# Altium schematic sheet connections.SchDoc
size A4; PageSetup: Record=PageOptions|CenterHorizontal=False|CenterVertical=False|PrintScale=1.00|XCorrection=1.00|YCorrection=1.00|PrintKind=1|BorderSize=5000000|LeftOffset=0|BottomOffset=0|Orientation=2|PaperLength=1000|PaperWidth=1000|Scale=100|PaperSource=7|PrintQuality=-4|MediaType=1|DitherType=10|PaperKind=A4|PrintScaleMode=0
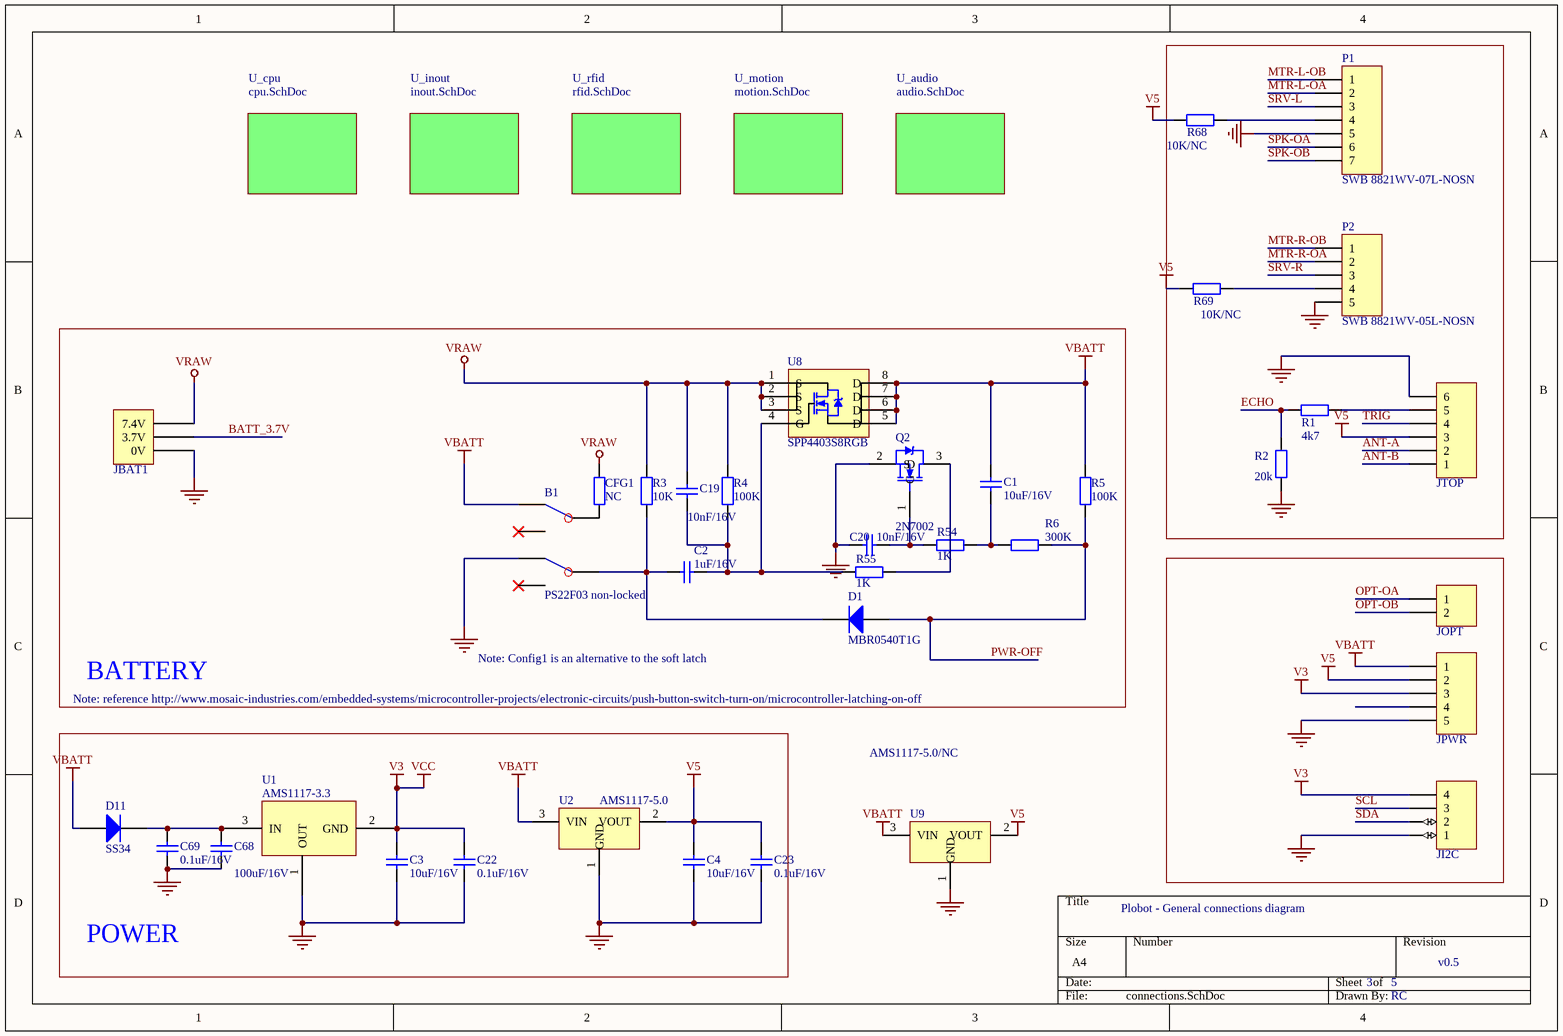
[diagram p0: connections.SchDoc]

## Parts
B1  PS22F03 non-locked  [KGPS22F03]
C1  10uF/16V  [CAPC1608N]
C2  1uF/16V  [CAPC1608N]
C3  10uF/16V  [CAPC1608N]
C4  10uF/16V  [CAPC1608N]
C19  10nF/16V  [CAPC1608N]
C20  10nF/16V  [CAPC1608N]
C22  0.1uF/16V  [CAPC1608N]
C23  0.1uF/16V  [CAPC1608N]
C68  100uF/16V  [Cap6.6X6.6]
C69  0.1uF/16V  [CAPC1608N]
CFG1  NC  [RESC1608N]
D1  MBR0540T1G  [SOD123/X.85]
D11  SS34  [SMB]
JBAT1  Charger  [S3B-XH-A(LF)(SN)]  (value not drawn)
JI2C  Header 4  [HDR1X4]  (value not drawn)
JOPT  Header 2  [HDR1X2]  (value not drawn)
JPWR  Component  [HDR1X5]  (value not drawn)
JTOP  w/lock  [JST-B6B-XH]  (value not drawn)
P1  SWB 8821WV-07L-NOSN  [XH2.54-7]
P2  SWB 8821WV-05L-NOSN  [XH2.54-5]
Q2  2N7002  [SOT23]
R1  4k7  [RESC1608N]
R2  20k  [RESC1608N]
R3  10K  [RESC1608N]
R4  100K  [RESC1608N]
R5  100K  [RESC1608N]
R6  300K  [RESC1608N]
R54  1K  [RESC1608N]
R55  1K  [RESC1608N]
R68  10K/NC  [RESC1608N]
R69  10K/NC  [RESC1608N]
U1  AMS1117-3.3  [SOT223]
U2  AMS1117-5.0  [TO252]
U8  SPP4403S8RGB  [SOP8]
U9  AMS1117-5.0/NC  [SOT-223]

## Blocks framed on the sheet
BATTERY: B1 C1 C2 C19 C20 CFG1 D1 JBAT1 Q2 R3-R6 R54 R55 U8
POWER: C3 C4 C22 C23 C68 C69 D11 U1 U2

## Sub-sheets
U_audio = audio.SchDoc: no entries
U_cpu = cpu.SchDoc: no entries
U_inout = inout.SchDoc: no entries
U_motion = motion.SchDoc: no entries
U_rfid = rfid.SchDoc: no entries

## Nets
GND: B1.4 C3.2 C4.1 C20.1 C22.1 C23.1 C68.1 C69.1 JBAT1.1(0V) JI2C.1 JPWR.5 JTOP.6 P1.5 P2.5 Q2.2(S) R2.2 U1.1(OUT) U2.1(GND) U9.1(GND)
V3: C3.1 C22.2 JI2C.4 JPWR.3 U1.2(GND)  [also labelled VCC]
V5: C4.2 C23.2 JPWR.2 JTOP.3 R68.1 R69.1 U2.2(VOUT) U9.2(VOUT)
VBATT: B1.3 C1.1 D11.1(A) JPWR.1 R5.2 U2.3(VIN) U8.5(D) U8.6(D) U8.7(D) U8.8(D) U9.3(VIN)
VRAW: C19.2 CFG1.1 JBAT1.3(7.4V) R3.2 R4.2 U8.1(S) U8.2(S) U8.3(S)
ANT-A: JTOP.2
ANT-B: JTOP.1
BATT_3.7V: JBAT1.2(3.7V)
ECHO: R1.1 R2.1
MTR-L-OA: P1.2
MTR-L-OB: P1.1
MTR-R-OA: P2.2
MTR-R-OB: P2.1
OPT-OA: JOPT.1
OPT-OB: JOPT.2
PWR-OFF: D1.2(A) R5.1 R6.1
SCL: JI2C.3
SDA: JI2C.2
SPK-OA: P1.6
SPK-OB: P1.7
SRV-L: P1.3
SRV-R: P2.3
TRIG: JTOP.4
NetB1_2: B1.2 CFG1.2
NetB1_5: B1.5 C2.1 D1.1(K) R3.1
NetC1_2: C1.2 R6.2 R54.1
NetC2_2: C2.2 C19.1 R4.1 R55.2 U8.4(G)
NetC20_2: C20.2 Q2.1(G) R54.2
NetC68_2: C68.2 C69.2 D11.2(K) U1.3(IN)
NetJTOP_5: JTOP.5 R1.2
NetP1_4: P1.4 R68.2
NetP2_4: P2.4 R69.2
NetQ2_3: Q2.3(D) R55.1

Not connected (* = marked no-connect by the designer): B1 1* 6*; JPWR 4

## Notes on the sheet
- Note: reference http://www.mosaic-industries.com/embedded-systems/microcontroller-projects/electronic-circuits/push-button-switch-turn-on/microcontroller-latching-on-off
- Note: Config1 is an alternative to the soft latch
- Plobot - General connections diagram
- 3
- 5
- v0.5
- RC

## Library data of the parts
B1 = Component_1
C1-C4 C19 C20 C22 C23 C69 = Cap_2: Capacitor; PackageReference: RAD-0.3
  C1: Value: 10uF/16V; ComponentLink2Description: Datasheet; ComponentLink3Description: DIGIKEY
  C2: Value: 1uF/16V; ComponentLink2Description: Datasheet; ComponentLink3Description: DIGIKEY
  C3: Published: 8-Jun-2000; LatestRevisionDate: 17-Jul-2002; LatestRevisionNote: Re-released for DXP Platform.; Publisher: Altium Limited; Value: 10uF/16V; PackageDescription: Radial Cap, Thru-Hole; 2 Leads; 0.3 in Pin Spacing
  C4: Published: 8-Jun-2000; LatestRevisionDate: 17-Jul-2002; LatestRevisionNote: Re-released for DXP Platform.; Publisher: Altium Limited; PackageDescription: Radial Cap, Thru-Hole; 2 Leads; 0.3 in Pin Spacing; Value: 10uF/16V
  C19 C20: Value: 10nF/16V; ComponentLink2Description: Datasheet; ComponentLink3Description: DIGIKEY
  C22 C23 C69: Value: 0.1uF/16V; ComponentLink2Description: Datasheet; ComponentLink3Description: DIGIKEY
C68 = Cap: Capacitor; Published: 8-Jun-2000; LatestRevisionDate: 17-Jul-2002; LatestRevisionNote: Re-released for DXP Platform.; PackageReference: RAD-0.3; Publisher: Altium Limited; PackageDescription: Radial Cap, Thru-Hole; 2 Leads; 0.3 in Pin Spacing; Value: 100uF/16V
CFG1 R1-R6 R54 R55 R68 R69 = Res2: Resistor; PackageReference: AXIAL-0.4
  CFG1: Value: NC; ComponentLink2Description: Datasheet; ComponentLink3Description: DIGIKEY
  R1: Published: 8-Jun-2000; LatestRevisionDate: 17-Jul-2002; LatestRevisionNote: Re-released for DXP Platform.; Publisher: Altium Limited; Value: 4k7
  R2: Published: 8-Jun-2000; LatestRevisionDate: 17-Jul-2002; LatestRevisionNote: Re-released for DXP Platform.; Publisher: Altium Limited; Value: 20k
  R3: Value: 10K; ComponentLink3Description: DIGIKEY
  R4 R5: Value: 100K; ComponentLink3Description: DIGIKEY
  R6: Value: 300K; ComponentLink3Description: DIGIKEY
  R54 R55: Value: 1K; ComponentLink3Description: DIGIKEY
  R68 R69: Published: 8-Jun-2000; LatestRevisionDate: 17-Jul-2002; LatestRevisionNote: Re-released for DXP Platform.; Publisher: Altium Limited; Value: 10K/NC
D1 = Diode: Default Diode; PackageReference: SMC; ComponentLink3Description: DIGIKEY; ComponentLink3URL: http://www.digikey.com/product-detail/en/fairchild-on-semiconductor/MBR0540/MBR0540TR-ND/1048787
D11 = Diode 1N4007: 1 Amp General Purpose Rectifier; Published: 8-Jun-2000; LatestRevisionDate: 17-Jul-2002; LatestRevisionNote: Re-released for DXP Platform.; DatasheetVersion: 1998; PackageVersion: Aug-1999; PackageReference: DO-41; Publisher: Altium Limited; PackageDescription: Diode, Axial; Body 5.2 x 2.7 mm (LxDia. max), Lead Dia. 0.86 mm (max); Code_JEDEC: DO-204-AL; ComponentLink1Description: Manufacturer Link; ComponentLink1URL: http://www.fairchildsemi.com/; ComponentLink2Description: Datasheet; ComponentLink2URL: http://www.fairchildsemi.com/ds/1N%2F1N4001.pdf
JBAT1 = BATTCON: ComponentLink3Description: TAOBAO; ComponentLink3URL: https://item.taobao.com/item.htm?spm=a1z09.2.0.0.HEqzjA&id=524112080121&_u=goqqgqg0b2c
JI2C = Header 4: Header, 4-Pin; ComponentLink3Description: DIGIKEY
JOPT = Header 2: Header, 2-Pin; LatestRevisionDate: 17-Jul-2002; LatestRevisionNote: Re-released for DXP Platform.; Publisher: Altium Limited
JPWR P2 = Header 5: Header, 5-Pin; LatestRevisionDate: 17-Jul-2002; LatestRevisionNote: Re-released for DXP Platform.; Publisher: Altium Limited
JTOP = Header 6: Header, 6-Pin; ComponentLink2Description: http://www.digikey.com/products/en?keywords=B6B-XH-A(LF)(SN); ComponentLink3Description: DIGIKEY
P1 = Header 7: Header, 7-Pin; LatestRevisionDate: 17-Jul-2002; LatestRevisionNote: Re-released for DXP Platform.; Publisher: Altium Limited
Q2 = 2N7002: NMOS
U1 = LM1117
U2 U9 = LM1117-3.3V